# Altium schematic sheet Timing Display Top.SchDoc
size OrCAD C; SheetNumber: 1; SheetTotal: 7
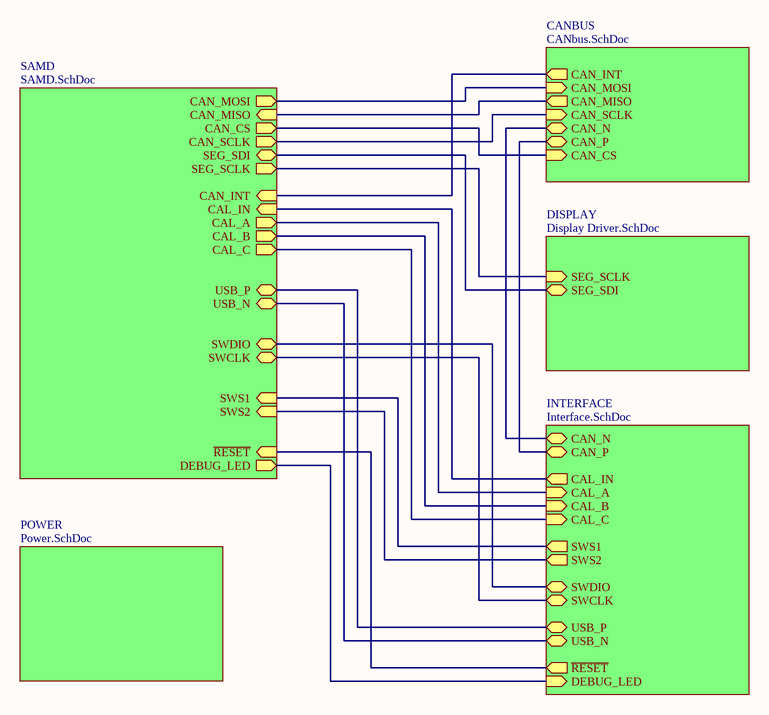
[diagram p0: Timing Display Top.SchDoc]

## Sub-sheets
CANBUS = CANbus.SchDoc: CAN_INT (out), CAN_MOSI (in), CAN_MISO (out), CAN_SCLK (in), CAN_CS (in), CAN_N (bidir), CAN_P (bidir)
DISPLAY = Display Driver.SchDoc: SEG_SCLK (in), SEG_SDI (bidir)
INTERFACE = Interface.SchDoc: CAL_C (in), ~{RESET} (out), CAL_A (in), SWDIO (bidir), CAL_B (in), SWCLK (bidir), CAL_IN (out), SWS2 (out), SWS1 (out), CAN_N (bidir), CAN_P (bidir), USB_N (bidir), USB_P (bidir), DEBUG_LED (in)
POWER = Power.SchDoc: no entries
SAMD = SAMD.SchDoc: CAL_IN (in), SWS2 (in), SWCLK (bidir), CAL_C (out), CAL_B (out), SWS1 (in), SEG_SDI (bidir), SWDIO (bidir), SEG_SCLK (out), ~{RESET} (in), CAL_A (out), CAN_MISO (in), CAN_SCLK (out), CAN_CS (out), CAN_MOSI (out), CAN_INT (in), USB_P (bidir), USB_N (bidir), DEBUG_LED (out)

## Nets
(unnamed): sheet SAMD/CAL_IN, sheet INTERFACE/CAL_IN
(unnamed): sheet SAMD/SWS2, sheet INTERFACE/SWS2
(unnamed): sheet SAMD/SWCLK, sheet INTERFACE/SWCLK
(unnamed): sheet SAMD/CAL_C, sheet INTERFACE/CAL_C
(unnamed): sheet SAMD/CAL_B, sheet INTERFACE/CAL_B
(unnamed): sheet SAMD/SWS1, sheet INTERFACE/SWS1
(unnamed): sheet SAMD/SEG_SDI, sheet DISPLAY/SEG_SDI
(unnamed): sheet SAMD/SWDIO, sheet INTERFACE/SWDIO
(unnamed): sheet SAMD/SEG_SCLK, sheet DISPLAY/SEG_SCLK
(unnamed): sheet SAMD/~{RESET}, sheet INTERFACE/~{RESET}
(unnamed): sheet SAMD/CAL_A, sheet INTERFACE/CAL_A
(unnamed): sheet SAMD/CAN_MISO, sheet CANBUS/CAN_MISO
(unnamed): sheet SAMD/CAN_SCLK, sheet CANBUS/CAN_SCLK
(unnamed): sheet SAMD/CAN_CS, sheet CANBUS/CAN_CS
(unnamed): sheet SAMD/CAN_MOSI, sheet CANBUS/CAN_MOSI
(unnamed): sheet SAMD/CAN_INT, sheet CANBUS/CAN_INT
(unnamed): sheet SAMD/USB_P, sheet INTERFACE/USB_P
(unnamed): sheet SAMD/USB_N, sheet INTERFACE/USB_N
(unnamed): sheet SAMD/DEBUG_LED, sheet INTERFACE/DEBUG_LED
(unnamed): sheet INTERFACE/CAN_N, sheet CANBUS/CAN_N
(unnamed): sheet INTERFACE/CAN_P, sheet CANBUS/CAN_P